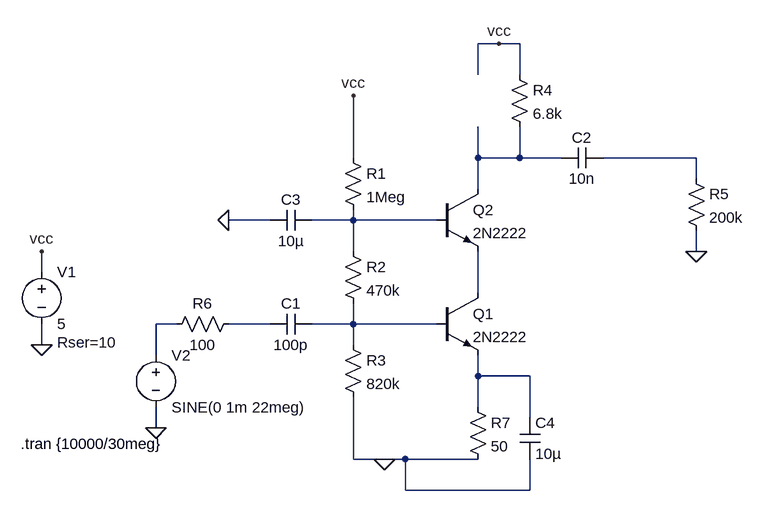
[diagram p0: schematic cascode.asc]
cascode.asc, the LTspice schematic file:
Version 4
SHEET 1 880 680
WIRE 384 -112 352 -112
WIRE 416 -112 384 -112
WIRE 352 -64 352 -112
WIRE 416 -64 416 -112
WIRE 160 64 160 -32
WIRE 352 64 352 16
WIRE 416 64 416 16
WIRE 416 64 352 64
WIRE 480 64 416 64
WIRE 688 64 544 64
WIRE 688 96 688 64
WIRE 352 112 352 64
WIRE 32 160 -32 160
WIRE 160 160 160 144
WIRE 160 160 96 160
WIRE 288 160 160 160
WIRE 160 208 160 160
WIRE 688 208 688 176
WIRE -320 240 -320 208
WIRE 352 272 352 208
WIRE -112 320 -144 320
WIRE 32 320 -32 320
WIRE 160 320 160 288
WIRE 160 320 96 320
WIRE 288 320 160 320
WIRE -320 352 -320 320
WIRE 160 352 160 320
WIRE -144 368 -144 320
WIRE 352 400 352 368
WIRE 432 400 352 400
WIRE 352 448 352 400
WIRE 432 464 432 400
WIRE -144 480 -144 448
WIRE 160 528 160 432
WIRE 208 528 160 528
WIRE 240 528 208 528
WIRE 352 528 240 528
WIRE 240 576 240 528
WIRE 432 576 432 528
WIRE 432 576 240 576
FLAG -320 352 0
FLAG -320 208 vcc
FLAG 384 -112 vcc
FLAG 160 -32 vcc
FLAG 208 528 0
FLAG -144 480 0
FLAG -32 160 0
FLAG 688 208 0
SYMBOL res 144 48 R0
SYMATTR InstName R1
SYMATTR Value 1Meg
SYMBOL res 144 192 R0
SYMATTR InstName R2
SYMATTR Value 470k
SYMBOL res 144 336 R0
SYMATTR InstName R3
SYMATTR Value 820k
SYMBOL npn 288 272 R0
SYMATTR InstName Q1
SYMATTR Value 2N2222
SYMBOL npn 288 112 R0
SYMATTR InstName Q2
SYMATTR Value 2N2222
SYMBOL res 400 -80 R0
SYMATTR InstName R4
SYMATTR Value 6.8k
SYMBOL voltage -320 224 R0
WINDOW 123 0 0 Left 0
WINDOW 39 24 124 Left 2
SYMATTR SpiceLine Rser=10
SYMATTR InstName V1
SYMATTR Value 5
SYMBOL voltage -144 352 R0
WINDOW 123 0 0 Left 0
WINDOW 39 0 0 Left 0
SYMATTR InstName V2
SYMATTR Value SINE(0 1m 22meg)
SYMBOL cap 96 304 R90
WINDOW 0 0 32 VBottom 2
WINDOW 3 32 32 VTop 2
SYMATTR InstName C1
SYMATTR Value 100p
SYMBOL cap 544 48 R90
WINDOW 0 0 32 VBottom 2
WINDOW 3 32 32 VTop 2
SYMATTR InstName C2
SYMATTR Value 10n
SYMBOL cap 96 144 R90
WINDOW 0 0 32 VBottom 2
WINDOW 3 32 32 VTop 2
SYMATTR InstName C3
SYMATTR Value 10µ
SYMBOL res -16 304 R90
WINDOW 0 0 56 VBottom 2
WINDOW 3 32 56 VTop 2
SYMATTR InstName R6
SYMATTR Value 100
SYMBOL res 336 432 R0
SYMATTR InstName R7
SYMATTR Value 50
SYMBOL cap 416 464 R0
SYMATTR InstName C4
SYMATTR Value 10µ
SYMBOL res 672 80 R0
SYMATTR InstName R5
SYMATTR Value 200k
TEXT -352 504 Left 2 !.tran {10000/30meg}

The netlist it stands for:
* cascode.asc
R1 vcc N003 1Meg
R2 N003 N007 470k
R3 N007 0 820k
Q1 N004 N007 N008 0 2N2222
Q2 N001 N003 N004 0 2N2222
R4 vcc N001 6.8k
V1 vcc 0 5 Rser=10
V2 N005 0 SINE(0 1m 22meg)
C1 N007 N006 100p
C2 N002 N001 10n
C3 N003 0 10µ
R6 N006 N005 100
R7 N008 0 50
C4 N008 0 10µ
R5 N002 0 200k
.model NPN NPN
.model PNP PNP
.lib standard.bjt
.tran {10000/30meg}
.backanno
.end